# EAGLE design lcd_bias_v3.6 (EAGLE 6.3)
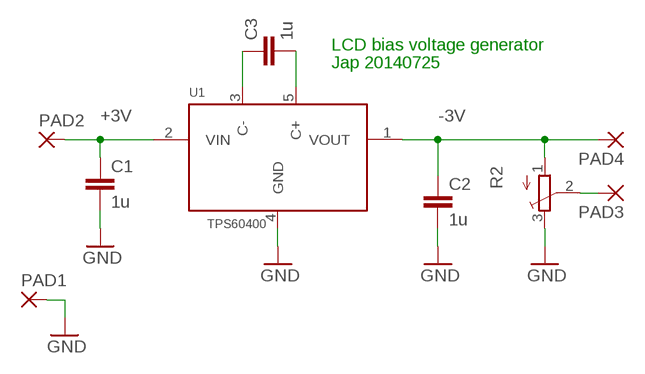
[diagram p0: schematic, sheet 1]

## Parts
C1  1u  C-EUC0603K  [C0603K]
C2  1u  C-EUC0603K  [C0603K]
C3  1u  C-EUC0603K  [C0603K]
PAD1  1,6/0,8  [1,6/0,8]
PAD2  1,6/0,8  [1,6/0,8]
PAD3  1,6/0,8  [1,6/0,8]
PAD4  1,6/0,8  [1,6/0,8]
R2  TRIMMER3305  [RTRIM3305]
U1  TPS60400  [SOT23-5]

## Nets
+3V: C1.1 PAD2.1(P) U1.2(VIN)
-3V: C2.1 PAD4.1(P) R2.1(A) U1.1(VOUT)
GND: C1.2 C2.2 PAD1.1(P) R2.3(E) U1.4(GND)
N$1: PAD3.1(P) R2.2(S)
N$2: C3.1 U1.3(C-)
N$3: C3.2 U1.5(C+)

## Notes on the sheet
- LCD bias voltage generator
- Jap 20140725

## Library data of the parts
C1-C3 = rcl:C-EU: CAPACITOR, European symbol
PAD1-PAD4 = wirepad:1,6/0,8: THROUGH-HOLE PAD
R2 = pot:TRIMMER: POTENTIOMETER
U1 = stepup:TPS60400

## Board
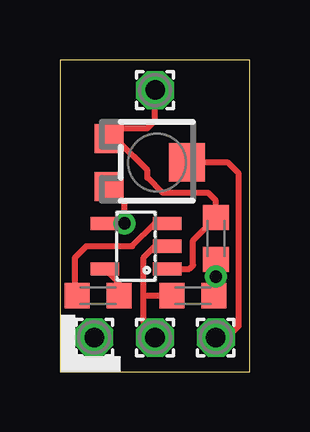
[diagram p1: board, top side]
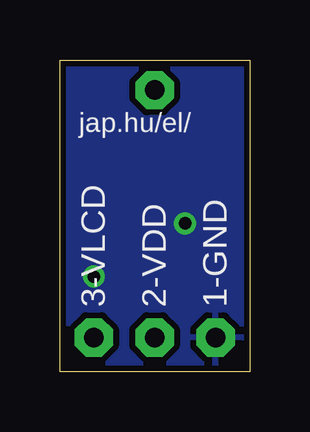
[diagram p2: board, bottom side, seen from below]

Size 7.93 x 13.01 mm. Coordinates in mm from the lower left corner, seen from the top.
Outline: 0,0 7.92,0 7.92,13.01 0,13.01 0,0
Copper layers (1*16): Top 0.035mm / dielectric 1.5mm / Bottom 0.035mm
Design rules "default *": minimum track width 10mil, minimum drill 24mil, track to track 8mil, track to pad 8mil, pad to pad 8mil, via to via 8mil, smd to smd 8mil, copper to edge 10mil, drill to drill 8mil, minimum pad ring 10mil, minimum via ring 8mil, stop-mask expansion 4mil, vias tented up to drill 20mil, thermal gap 10mil

### Footprints (pad centres in the part's own frame; a part is rotated, then mirrored left to right if it is on the bottom)
C0603K = smd 1.05 x 1.08: 1 -0.875,0; 2 0.875,0
1,6/0,8 = drill 0.813 pad 1.6 octagon: 1 0,0
RTRIM3305 = smd 1.2 x 1.2: 1 -1,-1.6; 3 1,-1.6 | smd 1.6 x 1.5: 2 0,1.65
SOT23-5 = smd 0.55 x 1.2: 1 -0.95,-1.3; 2 0,-1.3; 3 0.95,-1.3; 4 0.95,1.3; 5 -0.95,1.3

### Placement (x,y rotation side)
C1  5.56,3.18 0 top
C2  6.51,5.56 270 top
C3  1.59,3.18 0 top
PAD1  1.43,1.43 270 top
PAD2  3.97,1.43 270 top
PAD3  6.51,1.43 270 top
PAD4  3.97,11.75 0 top
R2  3.65,8.73 270 top
U1  3.18,5.24 90 top

### Tracks (layer width: path | path; a pad name or v marks a point on that pad's centre or on a via)
+3V
  Top 0.254: PAD2.1 3.49,2.06 3.49,3.17 | 3.49,3.17 | 3.49,3.17 3.49,4.76 3.97,5.24 U1.2 | 3.49,3.17 C1.1 | C1.1
-3V
  Top 0.254: U1.1 5.4,4.29 5.56,4.45 5.56,5.48 C2.1 | C2.1 6.43,6.51 | C2.1 6.51,7.14 6.19,7.46 4.29,7.46 3.65,8.1 3.65,8.41 2.44,9.63 R2.1 2.46,10.16 3.65,10.16 3.97,10.48 PAD4.1 | C2.1
GND  (via drill 0.51)
  Top 0.254: U1.4 v2.7,6.19 2.7,7.07 R2.3 | C2.2 v6.51,3.97 | v6.51,3.97 | C1.2 6.43,3.89 v6.51,3.97
  pour Bottom (isolate 0.254): 0,0 7.94,0 7.94,13.02 0,13.02
N$1
  Top 0.254: PAD3.1 6.98,1.43 7.46,1.91 7.46,8.28 7.01,8.73 R2.2
N$2
  Top 0.254: U1.3 3.97,6.19 3.02,5.24 1.11,5.24 0.63,4.76 0.63,3.25 C3.1
N$3
  Top 0.254: C3.2 2.46,3.7 U1.5

### Text on the board
bPlace: jap.hu/el/ | 1-GND | 2-VDD | 3-VLCD